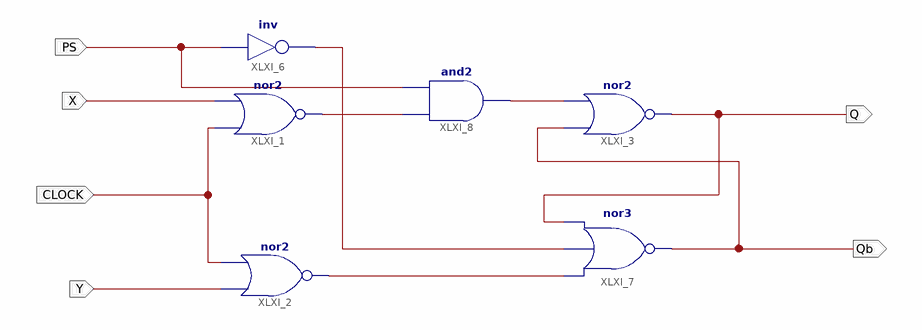
[diagram p0: schematic sheet 1]
// Xilinx ISE schematic SR_Latch_NOR.sch (artix7) as structural Verilog: 6 symbols, 6 ports
module SR_Latch_NOR (
  input  CLOCK,
  input  X,
  input  Y,
  input  PS,
  output Q,
  output Qb
);

  wire XLXN_7, XLXN_14, XLXN_17, XLXN_18;

  nor XLXI_1 (XLXN_14, CLOCK, X);
  nor XLXI_2 (XLXN_17, Y, CLOCK);
  nor XLXI_3 (Q, Qb, XLXN_7);
  not XLXI_6 (XLXN_18, PS);
  nor XLXI_7 (Qb, XLXN_17, XLXN_18, Q);
  and XLXI_8 (XLXN_7, XLXN_14, PS);
endmodule
